# Altium project mb1367.PrjPcb (part 1 of 2)
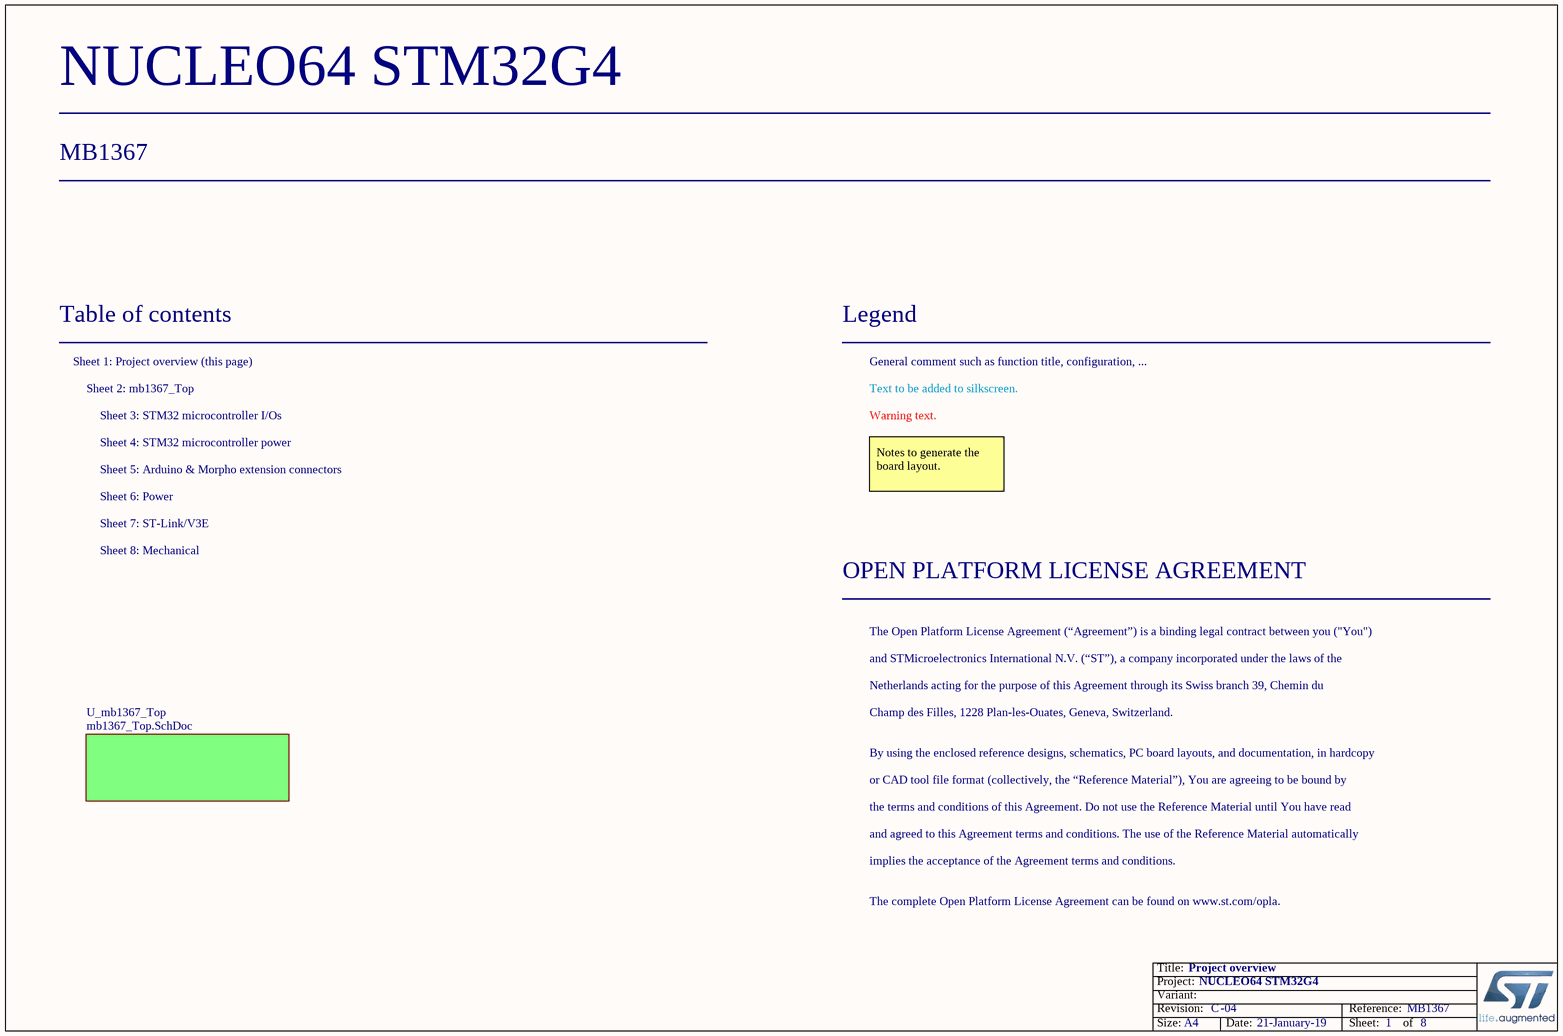
[diagram p0: Project_overview.SchDoc]
Board_Reference: MB1367; Board_PCB_Revision: C; Board_Name: NUCLEO64 STM32G4; Board_Document_Date: 21-January-19; Board_Assembly_Revision: 04
8 sheets, 201 parts. Net scope: flat (ports and power ports of the same name join across sheets).
Board file: MB1367C.PcbDoc
Sheets:
  Project_overview.SchDoc
    U_mb1367_Top = mb1367_Top.SchDoc
      U_Arduino_extension_connectors = Arduino_extension_connectors.SchDoc
      U_Power = Power.SchDoc
      U_STM32_microcontroller_IOs = STM32_microcontroller_IOs.SchDoc
      U_STM32_microcontroller_power = STM32_microcontroller_power.SchDoc
      U_ST_LINK_V3E = ST_LINK_V3E.SchDoc
      Mechanical = Mechanical.SchDoc

## Sheet Project_overview.SchDoc: Project overview
size A4; Date: Not used; ApprovedBy: Not used; CheckedBy: Not used; Author: Not used; CompanyName: STMicroelectronics; DrawnBy: Not used; Engineer: Not used; Organization: Not used; Address1: Not used; Address2: Not used; Address3: Not used; Address4: Not used; DocumentNumber: 1; Revision: Not used; SheetNumber: 1; SheetTotal: 8; CurrentTime: Not used; CurrentDate: Not used; Time: Not used; DocumentFullPathAndName: Not used; DocumentName: Not used; ModifiedDate: Not used; ImagePath: Not used; ProjectName: Not used; Application_BuildNumber: Not used

### Sub-sheets
U_mb1367_Top = mb1367_Top.SchDoc: no entries

### Notes on the sheet
- Table of contents
- Sheet 1: Project overview (this page)
- Legend
- General comment such as function title, configuration, ...
- Sheet 2: mb1367_Top
- Sheet 4: STM32 microcontroller power
- Sheet 3: STM32 microcontroller I/Os
- Text to be added to silkscreen.
- Warning text.
- Sheet 6: Power
- Sheet 5: Arduino & Morpho extension connectors
- Notes to generate the board layout.
- Sheet 7: ST-Link/V3E
- Sheet 8: Mechanical
- OPEN PLATFORM LICENSE AGREEMENT
- The Open Platform License Agreement (“Agreement”) is a binding legal contract between you ("You")
- and STMicroelectronics International N.V. (“ST”), a company incorporated under the laws of the
- Netherlands acting for the purpose of this Agreement through its Swiss branch 39, Chemin du
- Champ des Filles, 1228 Plan-les-Ouates, Geneva, Switzerland.
- By using the enclosed reference designs, schematics, PC board layouts, and documentation, in hardcopy
- or CAD tool file format (collectively, the “Reference Material”), You are agreeing to be bound by
- the terms and conditions of this Agreement. Do not use the Reference Material until You have read
- and agreed to this Agreement terms and conditions. The use of the Reference Material automatically
- implies the acceptance of the Agreement terms and conditions.
- The complete Open Platform License Agreement can be found on www.st.com/opla.
- Title:
- Project:
- Size:
- Revision:
- Variant:
- A4
- -
- Date:
- Reference:
- Sheet:
- of

## Sheet mb1367_Top.SchDoc: Top hierarchical view
size A4; Date: Not used; ApprovedBy: Not used; CheckedBy: Not used; Author: Not used; CompanyName: STMicroelectronics; DrawnBy: Not used; Engineer: Not used; Organization: Not used; Address1: Not used; Address2: Not used; Address3: Not used; Address4: Not used; DocumentNumber: 2; Revision: A-01-P3; SheetNumber: 2; SheetTotal: 8; CurrentTime: Not used; CurrentDate: Not used; Time: Not used; DocumentFullPathAndName: Not used; DocumentName: Not used; ModifiedDate: Not used; ImagePath: Not used; ProjectName: Not used; Application_BuildNumber: Not used
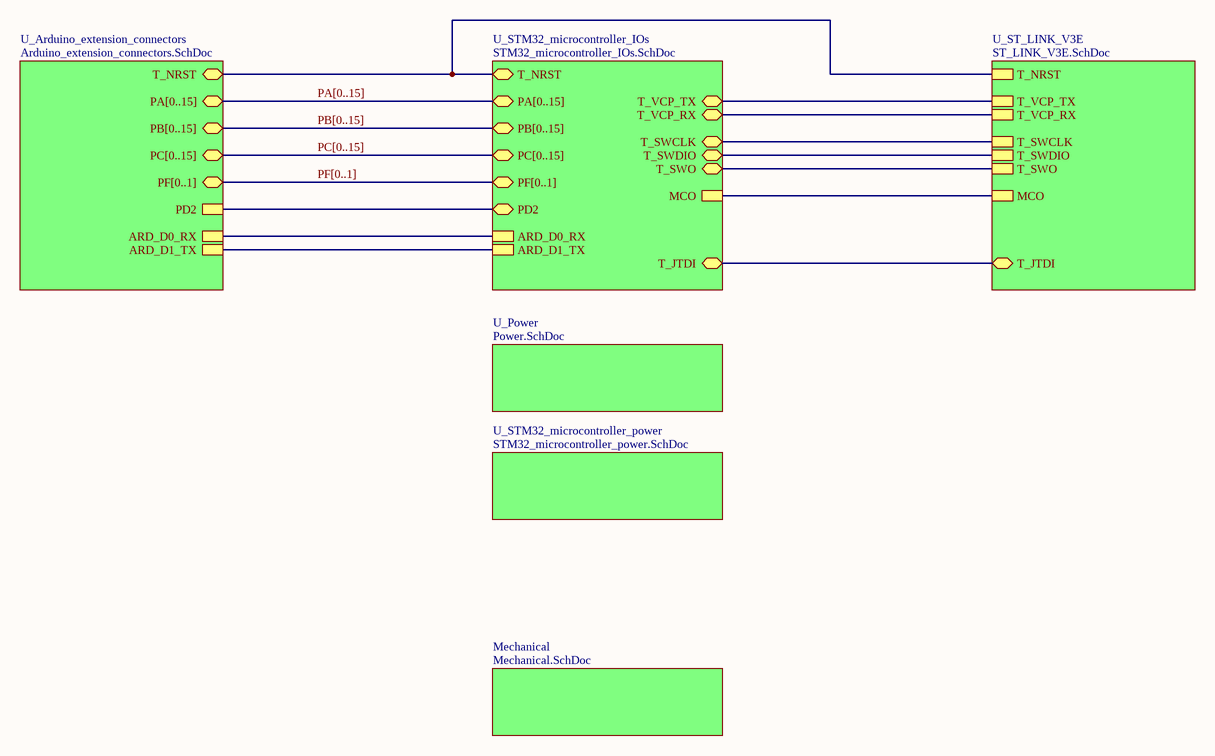
[diagram p1: mb1367_Top.SchDoc]

### Sub-sheets
Mechanical = Mechanical.SchDoc: no entries
U_Arduino_extension_connectors = Arduino_extension_connectors.SchDoc: PA[0..15] (bidir), PB[0..15] (bidir), PC[0..15] (bidir), PD2, PF[0..1] (bidir), ARD_D0_RX, ARD_D1_TX, T_NRST
U_Power = Power.SchDoc: no entries
U_ST_LINK_V3E = ST_LINK_V3E.SchDoc: T_SWCLK, T_SWO, T_NRST, MCO, T_SWDIO, T_VCP_TX, T_VCP_RX, T_JTDI
U_STM32_microcontroller_IOs = STM32_microcontroller_IOs.SchDoc: PA[0..15] (bidir), PB[0..15] (bidir), PC[0..15] (bidir), PF[0..1] (bidir), ARD_D0_RX, ARD_D1_TX, MCO, PD2, T_NRST, T_VCP_TX, T_VCP_RX, T_SWCLK, T_SWO, T_SWDIO, T_JTDI
U_STM32_microcontroller_power = STM32_microcontroller_power.SchDoc: no entries

### Nets
(unnamed): sheet U_Arduino_extension_connectors/PD2, sheet U_STM32_microcontroller_IOs/PD2
(unnamed): sheet U_Arduino_extension_connectors/ARD_D0_RX, sheet U_STM32_microcontroller_IOs/ARD_D0_RX
(unnamed): sheet U_Arduino_extension_connectors/ARD_D1_TX, sheet U_STM32_microcontroller_IOs/ARD_D1_TX
(unnamed): sheet U_Arduino_extension_connectors/T_NRST, sheet U_STM32_microcontroller_IOs/T_NRST, sheet U_ST_LINK_V3E/T_NRST
(unnamed): sheet U_STM32_microcontroller_IOs/MCO, sheet U_ST_LINK_V3E/MCO
(unnamed): sheet U_STM32_microcontroller_IOs/T_VCP_TX, sheet U_ST_LINK_V3E/T_VCP_TX
(unnamed): sheet U_STM32_microcontroller_IOs/T_VCP_RX, sheet U_ST_LINK_V3E/T_VCP_RX
(unnamed): sheet U_STM32_microcontroller_IOs/T_SWCLK, sheet U_ST_LINK_V3E/T_SWCLK
(unnamed): sheet U_STM32_microcontroller_IOs/T_SWO, sheet U_ST_LINK_V3E/T_SWO
(unnamed): sheet U_STM32_microcontroller_IOs/T_SWDIO, sheet U_ST_LINK_V3E/T_SWDIO
(unnamed): sheet U_STM32_microcontroller_IOs/T_JTDI, sheet U_ST_LINK_V3E/T_JTDI

### Buses and harness runs
bus PA[0..15] = sheet U_Arduino_extension_connectors/PA[0..15] = sheet U_STM32_microcontroller_IOs/PA[0..15]
bus PB[0..15] = sheet U_Arduino_extension_connectors/PB[0..15] = sheet U_STM32_microcontroller_IOs/PB[0..15]
bus PC[0..15] = sheet U_Arduino_extension_connectors/PC[0..15] = sheet U_STM32_microcontroller_IOs/PC[0..15]
bus PF[0..1] = sheet U_Arduino_extension_connectors/PF[0..1] = sheet U_STM32_microcontroller_IOs/PF[0..1]

### Notes on the sheet
- Cuttable part on PCB
- Title:
- Project:
- Size:
- Revision:
- Variant:
- A4
- -
- Date:
- Reference:
- Sheet:
- of

## Sheet Arduino_extension_connectors.SchDoc: Arduino & Morpho extension connectors
size A4; Date: Not used; ApprovedBy: Not used; CheckedBy: Not used; Author: Not used; CompanyName: STMicroelectronics; DrawnBy: Not used; Engineer: Not used; Organization: Not used; Address1: Not used; Address2: Not used; Address3: Not used; Address4: Not used; DocumentNumber: 5; Revision: Not used; SheetNumber: 5; SheetTotal: 8; CurrentTime: Not used; CurrentDate: Not used; Time: Not used; DocumentFullPathAndName: Not used; DocumentName: Not used; ModifiedDate: Not used; ImagePath: Not used; ProjectName: Not used; Application_BuildNumber: Not used
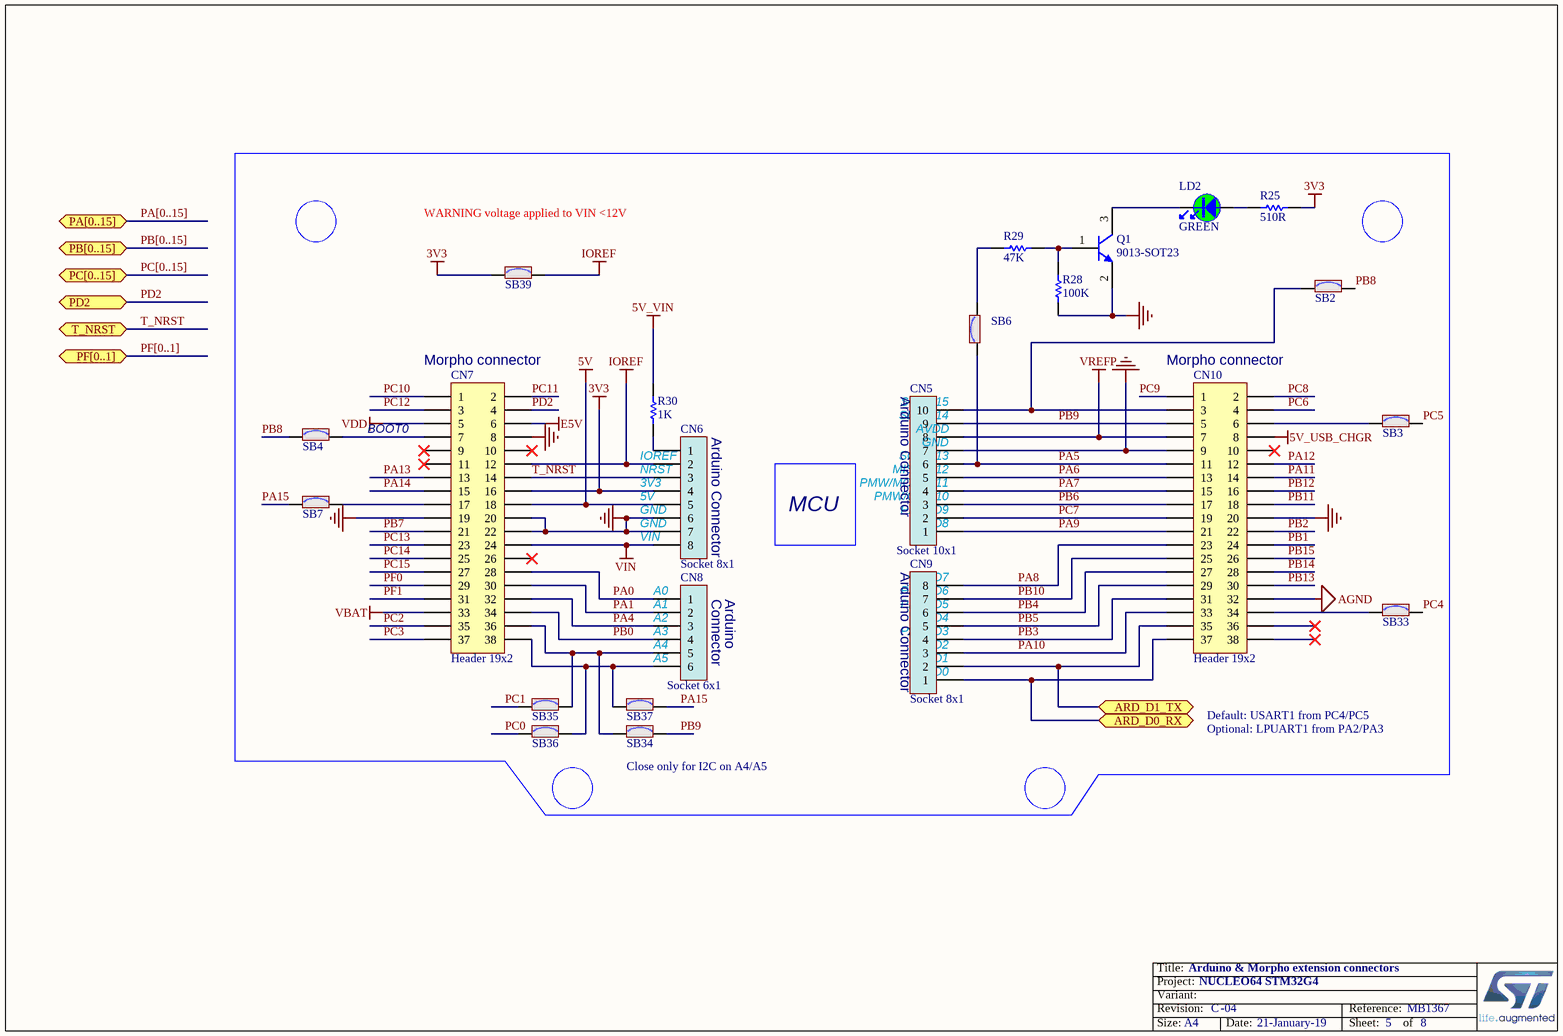
[diagram p2: Arduino_extension_connectors.SchDoc]

### Parts
CN5  value Socket 10x1  [CON_SAMTEC_SSW-110-03-X-S]
CN6  value Socket 8x1  [CON_SAMTEC_SSW-108-03-X-S]
CN7  value Header 19x2  [CON_SAMTEC_TSW-119-09-X-D]
CN8  value Socket 6x1  [CON_SAMTEC_SSW-106-03-X-S]
CN9  value Socket 8x1  [CON_SAMTEC_SSW-108-03-X-S]
CN10  value Header 19x2  [CON_SAMTEC_TSW-119-09-X-D]
LD2  value GREEN  [LED_0603_GREEN]
Q1  value 9013-SOT23  [NPN_SOT23]
R25  value 510R  [R0603]
R28  value 100K  [R0603]
R29  value 47K  [R0603]
R30  value 1K  [R0603]
SB2  (no value)  [SOLDER-BRIDGE_R0603-0R]
SB3  (no value)  [SOLDER-BRIDGE_R0603-0R]
SB4  (no value)  [SOLDER-BRIDGE_R0603-0R]
SB6  (no value)  [SOLDER-BRIDGE_R0603-0R]
SB7  (no value)  [SOLDER-BRIDGE_R0603-0R]
SB33  (no value)  [SOLDER-BRIDGE_R0603-0R]
SB34  (no value)  [SOLDER-BRIDGE_R0603-0R]
SB35  (no value)  [SOLDER-BRIDGE_R0603-0R]
SB36  (no value)  [SOLDER-BRIDGE_R0603-0R]
SB37  (no value)  [SOLDER-BRIDGE_R0603-0R]
SB39  (no value)  [SOLDER-BRIDGE_R0603-0R]

### Ports
ARD_D0_RX, ARD_D1_TX, PA[0..15] (bidir), PB[0..15] (bidir), PC[0..15] (bidir), PD2, PF[0..1] (bidir), T_NRST

### Nets
3V3: CN6.4 CN7.16 R25.1 SB39.1
5V: CN6.5 CN7.18
5V_USB_CHGR: CN10.8
5V_VIN: R30.2
AGND: CN10.32
E5V: CN7.6
GND: CN5.7 CN6.6 CN6.7 CN7.8 CN7.19 CN7.20 CN7.22 CN10.9 CN10.20 Q1.2(E) R28.1
IOREF: CN6.2 CN7.12 SB39.2
VBAT: CN7.33
VDD: CN7.5
VIN: CN6.8 CN7.24
VREFP: CN5.8 CN10.7
ARD_D0_RX: CN9.1 CN10.37 ; port ARD_D0_RX
ARD_D1_TX: CN9.2 CN10.35 ; port ARD_D1_TX
PA0: CN7.28 CN8.1
PA1: CN7.30 CN8.2
PA4: CN7.32 CN8.3
PA5: CN5.6 CN10.11 SB6.1
PA6: CN5.5 CN10.13
PA7: CN5.4 CN10.15
PA8: CN9.8 CN10.23
PA9: CN5.1 CN10.21
PA10: CN9.3 CN10.33
PA11: CN10.14
PA12: CN10.12
PA13: CN7.13
PA14: CN7.15
PA15: SB7.1 SB37.2
PB0: CN7.34 CN8.4
PB1: CN10.24
PB2: CN10.22
PB3: CN9.4 CN10.31
PB4: CN9.6 CN10.27
PB5: CN9.5 CN10.29
PB6: CN5.3 CN10.17
PB7: CN7.21
PB8: SB2.2 SB4.1
PB9: CN5.9 CN10.5 SB34.2
PB10: CN9.7 CN10.25
PB11: CN10.18
PB12: CN10.16
PB13: CN10.30
PB14: CN10.28
PB15: CN10.26
PC0: SB36.1
PC1: SB35.1
PC2: CN7.35
PC3: CN7.37
PC4: SB33.2
PC5: SB3.2
PC6: CN10.4
PC7: CN5.2 CN10.19
PC8: CN10.2
PC9: CN10.1
PC10: CN7.1
PC11: CN7.2
PC12: CN7.3
PC13: CN7.23
PC14: CN7.25
PC15: CN7.27
PD2: CN7.4 ; port PD2
PF0: CN7.29
PF1: CN7.31
T_NRST: CN6.3 CN7.14 ; port T_NRST
NetCN5_10: CN5.10 CN10.3 SB2.1
NetCN6_1: CN6.1 R30.1
NetCN7_7: CN7.7 SB4.2
NetCN7_17: CN7.17 SB7.2
NetCN7_36: CN7.36 CN8.5 SB34.1 SB35.2
NetCN7_38: CN7.38 CN8.6 SB36.2 SB37.1
NetCN10_6: CN10.6 SB3.1
NetCN10_34: CN10.34 SB33.1
NetLD2_1: LD2.1 R25.2
NetLD2_2: LD2.2 Q1.3(C)
NetQ1_1: Q1.1(B) R28.2 R29.2
NetR29_1: R29.1 SB6.2

Not connected (* = marked no-connect by the designer): CN7 9* 10* 11* 26*; CN10 10* 36* 38*

### Buses and harness runs
bus PA[0..15] = port PA[0..15]
bus PB[0..15] = port PB[0..15]
bus PC[0..15] = port PC[0..15]
bus PF[0..1] = port PF[0..1]

### Notes on the sheet
- WARNING voltage applied to VIN <12V
- (near CN7) Morpho connector
- (near CN10) Morpho connector
- (near CN7) BOOT0
- (near CN6) Arduino Connector
- (near CN5) Arduino Connector
- (near CN5) SDA/D14
- (near CN5) SCL/D15
- (near CN5) AVDD
- (near CN5) GND
- (near CN6) GND
- (near CN6) 5V
- (near CN6) 3V3
- (near CN6) NRST
- (near CN6) IOREF
- MCU
- (near CN5) PMW/D9
- (near CN5) PMW/CS/D10
- (near CN5) SCK/D13
- (near CN5) MISO/D12
- (near CN5) PMW/MOSI/D11
- (near CN6) VIN
- (near CN9) Arduino Connector
- (near CN9) D7
- (near CN5) D8
- (near CN8) A0
- (near CN8) A1
- (near CN8) A2
- (near CN8) A3
- (near CN8) A4
- (near CN8) Connector
- (near CN8) Arduino
- (near CN9) D2
- (near CN9) D4
- (near CN9) PMW/D3
- (near CN9) PMW/D5
- (near CN9) PMW/D6
- (near CN8) A5
- (near CN9) RX/D0
- (near CN9) TX/D1
- (near SB34) Close only for I2C on A4/A5
- Default: USART1 from PC4/PC5
  Optional: LPUART1 from PA2/PA3
- Title:
- Project:
- Size:
- Revision:
- Variant:
- -
- Date:
- Reference:
- Sheet:
- of

### Library data of the parts
CN5 = MCD-00262: Socket, 10x1, 2.54mm, VR, TH, Height 8.51mm/10mm; Manufacturer_Part_Number: SSW-110-03-x-S; Manufacturer: SAMTEC; Part_Type: Connector; Provided_By: Subcon; Initial_Board_Reference: MB1319; Internal_Part_Number: MCD-00262; ECCN_US: n/a; ECCN_EU: n/a; ComponentLink1Description: Samtec_SSW-SSQ-series.pdf; Status: Released; ComponentLink1URL: http://tunmcdsvn.tun.st.com/Component_Datasheet_Library/Trunk/Connectors/Samtec_SSW-SSQ-series
CN6 CN9 = MCD-00261: Socket, 8x1, 2.54mm, VR, TH, Height 8.51mm/10mm; Manufacturer_Part_Number: SSW-108-03-x-S; Manufacturer: SAMTEC; Part_Type: Connector; Provided_By: Subcon; Initial_Board_Reference: MB1319; Internal_Part_Number: MCD-00261; ECCN_US: n/a; ECCN_EU: n/a; ComponentLink1Description: Samtec_SSW-SSQ-series.pdf; Status: Released; ComponentLink1URL: http://tunmcdsvn.tun.st.com/Component_Datasheet_Library/Trunk/Connectors/Samtec_SSW-SSQ-series
CN7 CN10 = MCD-00213: Header, 19x2, 2,54mm, VR, TH, Height 5.84mm/10.16mm; Manufacturer_Part_Number: TSW-119-09-x-D; Manufacturer: SAMTEC; Part_Type: Connector; Provided_By: Subcon; Initial_Board_Reference: MB1319; Internal_Part_Number: MCD-00213; ECCN_US: n/a; ECCN_EU: n/a; ComponentLink1Description: Samtec_connector_TSW-HTSW-series.pdf; Status: Released; ComponentLink1URL: http://tunmcdsvn.tun.st.com/Component_Datasheet_Library/Trunk/Connectors/Samtec_TSW-HTSW-series
CN8 = MCD-00260: Socket, 6x1, 2.54mm, VR, TH, Height 8.51mm/10mm; Manufacturer_Part_Number: SSW-106-03-x-S; Manufacturer: SAMTEC; Part_Type: Connector; Provided_By: Subcon; Initial_Board_Reference: MB1319; Internal_Part_Number: MCD-00260; ECCN_US: n/a; ECCN_EU: n/a; ComponentLink1Description: Samtec_SSW-SSQ-series.pdf; Status: Released; ComponentLink1URL: http://tunmcdsvn.tun.st.com/Component_Datasheet_Library/Trunk/Connectors/Samtec_SSW-SSQ-series
LD2 = MCD-00050: LED, Green, 0603; Manufacturer_Part_Number: 19-213SYGC/S530-E2/TR8; Manufacturer: EVERLIGHT; Part_Type: Display; ECCN_US: EAR99; ECCN_EU: NEC; Provided_By: Subcon; Initial_Board_Reference: MB1274; Internal_Part_Number: MCD-00050; ComponentLink1Description: Everlight_SMD-LED-GREEN_19-213SYGC-S530-XX-TR8-v3.doc.pdf; Status: Released; ComponentLink1URL: http://tunmcdsvn.tun.st.com/Component_Datasheet_Library/Trunk/display/Everlight_SMD-LED-GREEN_19-213SYGC-S530-XX-TR8-v3.doc; Package: LED 0603
Q1 = MCD-00073: NPN Bipolar Transistor; Part_Type: IC; Manufacturer_Part_Number: BSR14; Manufacturer: NXP; ECCN_US: EAR99; ECCN_EU: NEC; Provided_By: Subcon; Initial_Board_Reference: MB1274; Revision: *; Internal_Part_Number: MCD-00073; Status: Released; ComponentLink1Description: NXP_Transistor_BSR14.pdf; ComponentLink1URL: http://tunmcdsvn.tun.st.com/Component_Datasheet_Library/Trunk/IC/NXP_Transistor_BSR14
R25 = MCD-00225: Resistor,510R,0603,1%,1/10W; Manufacturer_Part_Number: RC0603FR-07510RL; Manufacturer: YAGEO; Provided_By: Subcon; Initial_Board_Reference: MB1319; Internal_Part_Number: MCD-00225; ECCN_US: n/a; ECCN_EU: n/a; ComponentLink1Description: Yageo_Resistor_RC0603-series.pdf; Status: Released; Part_Type: Resistor; Package: R0603; ComponentLink1URL: http://tunmcdsvn.tun.st.com/Component_Datasheet_Library/Trunk/Resistors/Yageo_Resistor_RC0603-series
R28 = MCD-00223: Resistor,100K,0603,1%,1/10W; Manufacturer_Part_Number: RC0603FR-07100KL; Manufacturer: YAGEO; Provided_By: Subcon; Initial_Board_Reference: MB1319; Internal_Part_Number: MCD-00223; Status: Released; Part_Type: Resistor; ComponentLink1Description: Yageo_Resistor_RC0603-series.pdf; ECCN_US: n/a; ECCN_EU: n/a; Package: R0603; ComponentLink1URL: http://tunmcdsvn.tun.st.com/Component_Datasheet_Library/Trunk/Resistors/Yageo_Resistor_RC0603-series
R29 = MCD-00222: Resistor,47K,0603,1%,1/10W; Manufacturer_Part_Number: RC0603FR-0747KL; Manufacturer: YAGEO; Provided_By: Subcon; Initial_Board_Reference: MB1319; Internal_Part_Number: MCD-00222; Status: Released; Part_Type: Resistor; ComponentLink1Description: Yageo_Resistor_RC0603-series.pdf; ECCN_US: n/a; ECCN_EU: n/a; Package: R0603; ComponentLink1URL: http://tunmcdsvn.tun.st.com/Component_Datasheet_Library/Trunk/Resistors/Yageo_Resistor_RC0603-series
R30 = MCD-00070: Resistor,1K,0603,1%,1/10W; Manufacturer_Part_Number: RC0603FR-071KL; Manufacturer: YAGEO; Provided_By: Subcon; Initial_Board_Reference: MB1274; Internal_Part_Number: MCD-00070; ComponentLink1Description: Yageo_Resistor_RC0603-series.pdf; ECCN_US: n/a; ECCN_EU: n/a; Status: Released; Part_Type: Resistor; Package: R0603; ComponentLink1URL: http://tunmcdsvn.tun.st.com/Component_Datasheet_Library/Trunk/Resistors/Yageo_Resistor_RC0603-series
SB2-SB4 SB6 SB7 SB33-SB37 SB39 = MCD-00071: Solder Bridge ON; Part_Type: Mechanical; Provided_By: Subcon; Initial_Board_Reference: MB1274; Internal_Part_Number: MCD-00071; ECCN_US: n/a; ECCN_EU: n/a; Status: Released

## Sheet Power.SchDoc: Main power 5V / 3V3
size A4; Date: Not used; ApprovedBy: Not used; CheckedBy: Not used; Author: Not used; CompanyName: STMicroelectronics; DrawnBy: Not used; Engineer: Not used; Organization: Not used; Address1: Not used; Address2: Not used; Address3: Not used; Address4: Not used; DocumentNumber: 6; Revision: Not used; SheetNumber: 6; SheetTotal: 8; CurrentTime: Not used; CurrentDate: Not used; Time: Not used; DocumentFullPathAndName: Not used; DocumentName: Not used; ModifiedDate: Not used; ImagePath: Not used; ProjectName: Not used; Application_BuildNumber: Not used
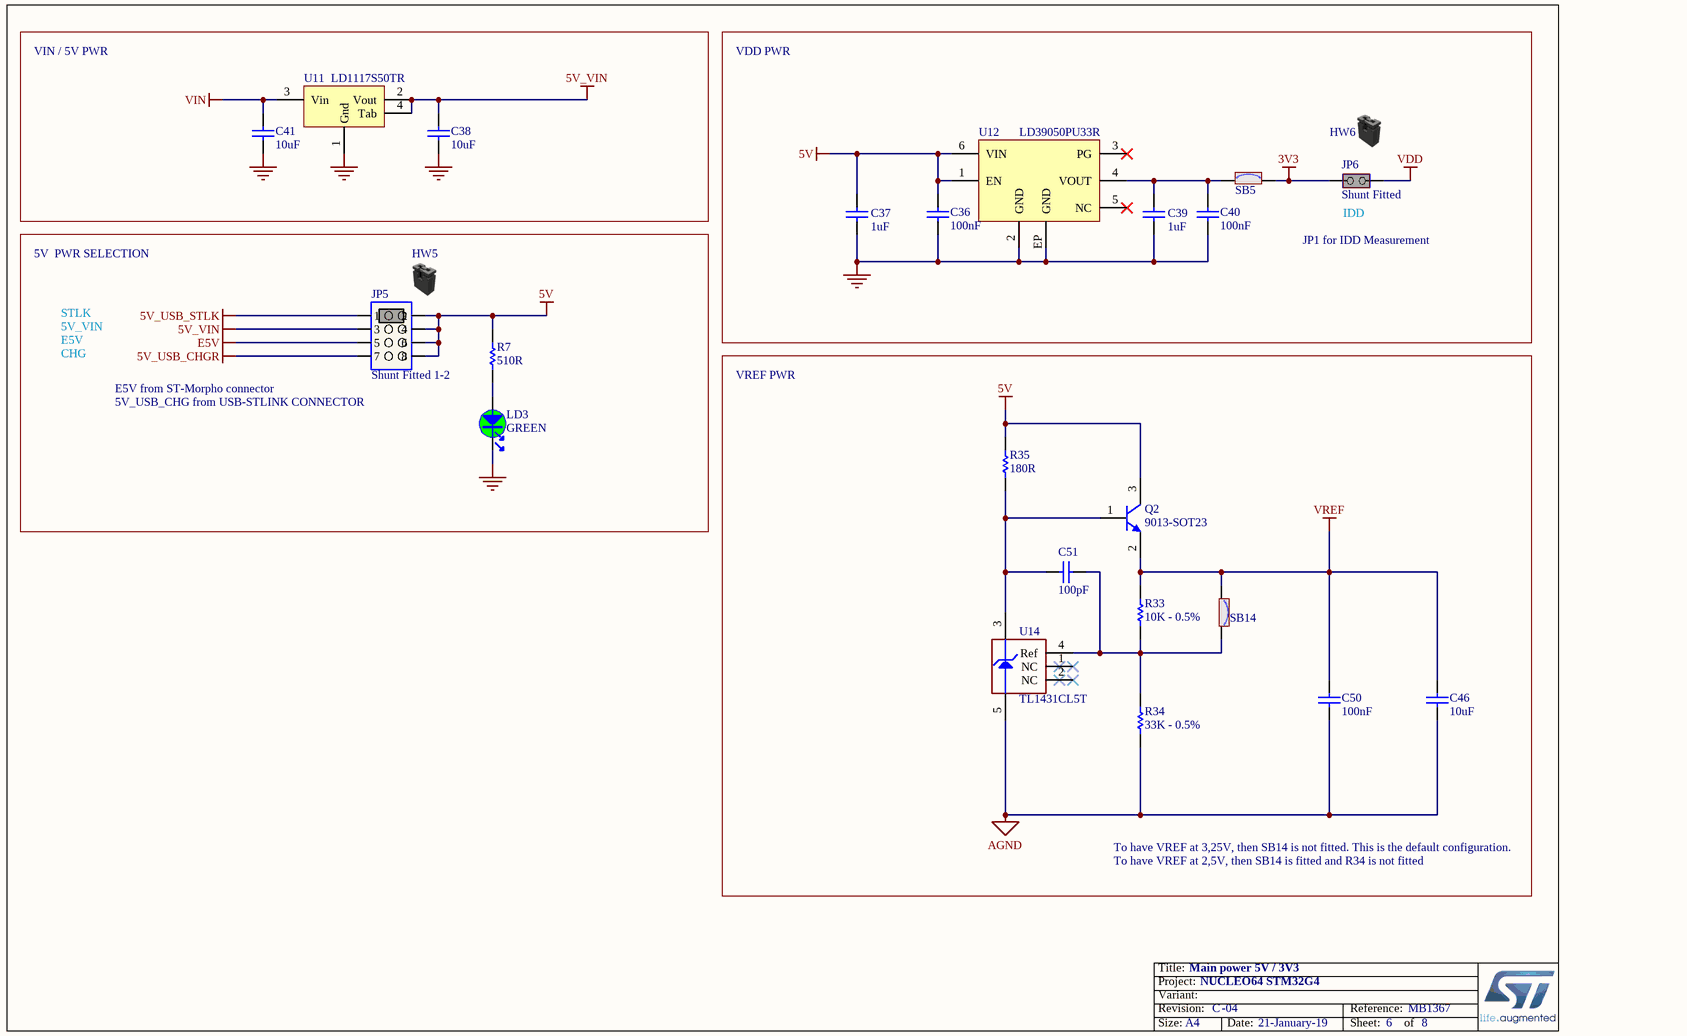
[diagram p3: Power.SchDoc]

### Parts
C36  value 100nF  [C0402]
C37  value 1uF  [C0603]
C38  value 10uF  [C0805]
C39  value 1uF  [C0603]
C40  value 100nF  [C0402]
C41  value 10uF  [C0805]
C46  value 10uF  [C0603]  (hidden comment: Capacitor)
C50  value 100nF  [C0603]
C51  value 100pF  [C0603]  (hidden comment: Capacitor)
HW5  (no value)  (mechanical)
HW6  (no value)  (mechanical)
JP5  Shunt Fitted 1-2  [CON_SAMTEC_TSW-104-07-X-D]
JP6  Shunt Fitted  [CON_SAMTEC_TSW-102-07-G-S]
LD3  value GREEN  [LED_0603_GREEN]
Q2  value 9013-SOT23  [NPN_SOT23]
R7  value 510R  [R0603]
R33  value 10K - 0.5%  [R0603]  (hidden comment: ​Add 0.5% tolerance resistor)
R34  value 33K - 0.5%  [R0603]  (hidden comment: ​add 0.5% tolerance resistor)
R35  value 180R  [R0603]  (hidden comment: Resistor)
SB5  (no value)  [SOLDER-BRIDGE_R0603-0R]
SB14  (no value)  [SOLDER-BRIDGE_R0603-0R]
U11  value LD1117S50TR  [REG_SOT223-TAB]
U12  value LD39050PU33R  [ICC_DFN6-EPAD_3X3_P095]
U14  value TL1431CL5T  [ICC_SOT23-5L_H1P45]  (hidden comment: TL1431ACL5T)

### Blocks framed on the sheet
VIN / 5V PWR: C38 C41 U11
VREF PWR: C46 C50 C51 Q2 R33-R35 SB14 U14

### Nets
3V3: JP6.1(COMMON) SB5.2
5V: C36.2 C37.2 JP5.2 JP5.4 JP5.6 JP5.8 Q2.3(C) R7.2 R35.2 U12.1(EN) U12.6(VIN)
5V_USB_CHGR: JP5.7
5V_USB_STLK: JP5.1
5V_VIN: C38.2 JP5.3 U11.2(Vout) U11.4(Tab)
AGND: C46.1 C50.1 R34.1 U14.5(Anode)
E5V: JP5.5
GND: C36.1 C37.1 C38.1 C39.1 C40.1 C41.1 LD3.2 U11.1(Gnd) U12.2(GND) U12.EP(GND)
VDD: JP6.2(NO)
VIN: C41.2 U11.3(Vin)
VREF: C46.2 C50.2 Q2.2(E) R33.2 SB14.1
NetC39_2: C39.2 C40.2 SB5.1 U12.4(VOUT)
NetC51_1: C51.1 Q2.1(B) R35.1 U14.3(Cathode)
NetC51_2: C51.2 R33.1 R34.2 SB14.2 U14.4(Ref)
NetLD3_1: LD3.1 R7.1

Not connected (* = marked no-connect by the designer): U12 3(PG)* 5(NC)*; U14 1(NC)* 2(NC)*

### Notes on the sheet
- VDD PWR
- JP1 for IDD Measurement
- (near JP6) IDD
- 5V  PWR SELECTION
- STLK
- E5V
- 5V_VIN
- CHG
- E5V from ST-Morpho connector
- 5V_USB_CHG from USB-STLINK CONNECTOR
- To have VREF at 3,25V, then SB14 is not fitted. This is the default configuration.
- To have VREF at 2,5V, then SB14 is fitted and R34 is not fitted
- Title:
- Project:
- Size:
- Revision:
- Variant:
- A4
- -
- Date:
- Reference:
- Sheet:
- of

### Library data of the parts
C36 C40 = MCD-00102: Capacitor, MLCC, 100nF, 16V, X7R, 10%, 0402, T=0,5mm; Manufacturer_Part_Number: CC0402KRX7R7BB104; Manufacturer: YAGEO; Provided_By: Subcon; Initial_Board_Reference: MB1262; Internal_Part_Number: MCD-00102; Status: Released; Package: C0402; ComponentLink1Description: Yageo_Capacitor_X7R-series.pdf; ECCN_US: n/a; ECCN_EU: n/a; Part_Type: Capacitor; ComponentLink1URL: http://tunmcdsvn.tun.st.com/Component_Datasheet_Library/Trunk/Capacitors/Yageo_Multilayer_Capacitor_X7R_series_100pF_to_22uF
C37 C39 = MCD-00010: Capacitor, MLCC, 1uF, 16V, X5R, 10%, 0603, T=0,8mm; Manufacturer_Part_Number: CC0603KRX5R7BB105; Manufacturer: YAGEO; Provided_By: Subcon; Initial_Board_Reference: MB1274; Internal_Part_Number: MCD-00010; Status: Released; Package: C0603; ComponentLink1Description: Yageo_Capacitor_X5R-series.pdf; ECCN_US: n/a; ECCN_EU: n/a; Part_Type: Capacitor; ComponentLink1URL: http://tunmcdsvn.tun.st.com/Component_Datasheet_Library/Trunk/Capacitors/Yageo_Multilayer_capacitor_X5R_series_100pF_to_100uF
C38 C41 = MCD-00014: Capacitor, MLCC, 10uF, 25V, X5R, 10%, 0805, T=0,85mm; Manufacturer_Part_Number: CC0805KRX5R8BB106; Manufacturer: YAGEO; Provided_By: Subcon; Initial_Board_Reference: MB1274; Internal_Part_Number: MCD-00014; ECCN_US: n/a; ECCN_EU: n/a; ComponentLink1Description: Yageo_Capacitor_X5R-series.pdf; Status: Released; Part_Type: Capacitor; Package: C0805; ComponentLink1URL: http://tunmcdsvn.tun.st.com/Component_Datasheet_Library/Trunk/Capacitors/Yageo_Multilayer_capacitor_X5R_series_100pF_to_100uF
C46 = MCD-01124: Capacitor, MLCC, 10µF, 10V, X5R, 10%, 0603, T=0.8mm; Manufacturer_Part_Number: GRM188R61A106KAAL; Manufacturer: MURATA; ECCN_US: EAR99; ECCN_EU: NEC; Provided_By: Subcon; Initial_Board_Reference: MB1361; Internal_Part_Number: MCD-01124; Status: Footprint available; Part_Type: Capacitor; Package: C0603; ComponentLink1Description: Murata_Capacitor_GRM188R61A106KAAL.pdf; ComponentLink1URL: http://tunmcdsvn.tun.st.com/Component_Datasheet_Library/Trunk/Capacitors/Murata_Capacitor_GR_series
C50 = MCD-00211: Capacitor, MLCC, 100nF, 16V, X7R, 10%, 0603, T=0,8mm; Manufacturer_Part_Number: CC0603KRX7R7BB104; Manufacturer: YAGEO; Provided_By: Subcon; Initial_Board_Reference: MB1319; Internal_Part_Number: MCD-00211; Status: Released; Part_Type: Capacitor; Package: C0603; ComponentLink1Description: Yageo_Capacitor_X7R-series.pdf; ComponentLink1URL: http://tunmcdsvn.tun.st.com/Component_Datasheet_Library/Trunk/Capacitors/Yageo_Multilayer_Capacitor_X7R_series_100pF_to_22uF; ECCN_US: n/a; ECCN_EU: n/a
C51 = MCD-01101: Capacitor,100pF,50V,X7R,10%,0603; Manufacturer_Part_Number: 06035C101JAT4A; Manufacturer: AVX; Provided_By: Subcon; Initial_Board_Reference: MB1381; Internal_Part_Number: MCD-01101; Status: Footprint available; Part_Type: Capacitor; Package: C0603; ComponentLink1Description: AVX_X7R-series.pdf; ComponentLink1URL: http://tunmcdsvn.tun.st.com/Component_Datasheet_Library/Trunk/Capacitors/AVX_Capacitor_X7R-series/AVX_X7R-series.pdf; ECCN_US: n/a; ECCN_EU: n/a
HW5 HW6 = MCD-00043: SHUNT 2.54mm BLACK; Manufacturer_Part_Number: SNT-100-BK-G; Manufacturer: SAMTEC; Part_Type: Mechanical; Provided_By: Subcon; Initial_Board_Reference: MB1274; Internal_Part_Number: MCD-00043; ECCN_US: n/a; ECCN_EU: n/a; ComponentLink1Description: Samtec_Shunt_Jumper_SNT100.pdf; Status: Released; ComponentLink1URL: http://tunmcdsvn.tun.st.com/Component_Datasheet_Library/Trunk/Connectors/Samtec_Shunt_Jumper_SNT100
JP5 = MCD-00686: Header, 4x2, 2,54mm, VR, TH, Height 5.84mm/2.54mm - Shunt Fitted 1-2; Part_Type: Connector; Manufacturer_Part_Number: TSW-104-07-x-D; Manufacturer: SAMTEC; Provided_By: Subcon; Initial_Board_Reference: MB1331; Internal_Part_Number: MCD-00686; Value: Shunt Fitted 1-2; Status: Symbol available; ComponentLink1Description: Samtec_TSW-HTSW-series.pdf; ComponentLink1URL: http://tunmcdsvn.tun.st.com/Component_Datasheet_Library/Trunk/Connectors/Samtec_TSW-HTSW-series; ECCN_US: n/a; ECCN_EU: n/a
JP6 = MCD-00683: Header, 2x1, 2,54mm, VR, TH, Height 5.84mm/2.54mm - Shunt Fitted by default; Part_Type: Connector; Manufacturer_Part_Number: TSW-102-07-x-S; Manufacturer: SAMTEC; Provided_By: Subcon; Initial_Board_Reference: MB1331; Internal_Part_Number: MCD-00683; Value: Shunt Fitted; Status: Released; ComponentLink1Description: Samtec_connector_TSW-HTSW-series.pdf; ComponentLink1URL: http://tunmcdsvn.tun.st.com/Component_Datasheet_Library/Trunk/Connectors/Samtec_TSW-HTSW-series; ECCN_US: n/a; ECCN_EU: n/a
LD3 = MCD-00050: as LD2 on sheet Arduino_extension_connectors; Internal_Part_Number: MCD-00050; ComponentLink1Description: Everlight_SMD-LED-GREEN_19-213SYGC-S530-XX-TR8-v3.doc.pdf; Status: Released; ComponentLink1URL: http://tunmcdsvn.tun.st.com/Component_Datasheet_Library/Trunk/display/Everlight_SMD-LED-GREEN_19-213SYGC-S530-XX-TR8-v3.doc; Package: LED 0603
Q2 = MCD-00073: as Q1 on sheet Arduino_extension_connectors; Revision: *; Internal_Part_Number: MCD-00073; Status: Released; ComponentLink1Description: NXP_Transistor_BSR14.pdf; ComponentLink1URL: http://tunmcdsvn.tun.st.com/Component_Datasheet_Library/Trunk/IC/NXP_Transistor_BSR14
R7 = MCD-00225: as R25 on sheet Arduino_extension_connectors; Internal_Part_Number: MCD-00225; ECCN_US: n/a; ECCN_EU: n/a; ComponentLink1Description: Yageo_Resistor_RC0603-series.pdf; Status: Released; Part_Type: Resistor; Package: R0603; ComponentLink1URL: http://tunmcdsvn.tun.st.com/Component_Datasheet_Library/Trunk/Resistors/Yageo_Resistor_RC0603-series
R33 = MCD-01215: resistor, 10K, 0603, 0.5%, 1/10W; Manufacturer_Part_Number: RC0603DR-0710KL; Manufacturer: YAGEO; ECCN_US: NA; Provided_By: Subcon; Initial_Board_Reference: MB1367; Internal_Part_Number: MCD-01215; Status: Checked; Part_Type: Resistor; Package: R0603; ComponentLink1Description: RC_Group_51_RoHS_L_7.pdf; ComponentLink1URL: http://tunmcdsvn.tun.st.com/Component_Datasheet_Library/Trunk/Resistors/Yageo_Resistor_RC0603-series/RC_Group_51_RoHS_L_7.pdf; ECCN_EU: NA
R34 = MCD-01209: Resistor,33K,0603,0.5%,1/10W; Manufacturer_Part_Number: RC0603DR-0733KL; Manufacturer: YAGEO; Provided_By: Subcon; Initial_Board_Reference: MB1367; Internal_Part_Number: MCD-01209; Status: Checked; Part_Type: Resistor; Package: R0603; ComponentLink1Description: RC_Group_51_RoHS_L_7.pdf; ComponentLink1URL: http://tunmcdsvn.tun.st.com/Component_Datasheet_Library/Trunk/Resistors/Yageo_Resistor_RC0603-series/RC_Group_51_RoHS_L_7.pdf; ECCN_US: n/a; ECCN_EU: n/a
R35 = MCD-00342: Resistor,180R,0603,1%,1/10W; Manufacturer_Part_Number: RC0603FR-07180RL; Manufacturer: YAGEO; ECCN_US: EAR99; ECCN_EU: NEC; Provided_By: SUBCO; Internal_Part_Number: MCD-00342; Status: Released; Part_Type: Resistor; Package: R0603; ComponentLink1Description: Datasheet; ComponentLink1URL: http://tunmcdsvn.tun.st.com/Component_Datasheet_Library/Trunk/Resistors/Yageo_Resistor_RC0603-series
SB5 SB14 = MCD-00071: as SB2 on sheet Arduino_extension_connectors; Internal_Part_Number: MCD-00071; ECCN_US: n/a; ECCN_EU: n/a; Status: Released
U11 = MCD-00088: IC REG LDO 5V 0.8A SOT223; Manufacturer: STMICROELECTRONICS; ECCN_US: EAR99; ECCN_EU: NEC; Provided_By: Subcon; Initial_Board_Reference: MB1274; Internal_Part_Number: MCD-00088; Manufacturer_Part_Number: LD1117S50TR; ComponentLink1Description: STM_LDO_LD1117.pdf; Status: Released; Part_Type: IC; ComponentLink1URL: http://tunmcdsvn.tun.st.com/Component_Datasheet_Library/Trunk/IC/STM_LDO_LD1117
U12 = MCD-00215: Low quiescent current and low noise voltage regulators; Manufacturer: STMICROELECTRONICS; Part_Type: IC; ECCN_US: EAR99; ECCN_EU: NEC; Provided_By: Subcon; Initial_Board_Reference: MB1319; Internal_Part_Number: MCD-00215; Manufacturer_Part_Number: LD39050PU33R; Status: Released; ComponentLink1Description: STM_LDO_LD39050PU.pdf; ComponentLink1URL: http://tunmcdsvn.tun.st.com/Component_Datasheet_Library/Trunk/IC/STM_LDO_LD39050PU
U14 = MCD-01802: Programmable voltage reference with 0.4% voltage precision; Part_Type: IC; Manufacturer: STMICROELECTRONICS; ECCN_US: EAR99; ECCN_EU: NEC; Provided_By: SUBCO with ST control; Internal_Part_Number: MCD-01802; Status: Footprint available; Manufacturer_Part_Number: TL1431CL5T; Package: SOT23-5L; ComponentLink1Description: Datasheet; ComponentLink1URL: http://tunmcdsvn.tun.st.com/Component_Datasheet_Library/Trunk/IC/STM_voltage_reference_TL1431ACL5T/

## Sheet STM32_microcontroller_IOs.SchDoc: STM32 microcontroller I/Os
size A4; Date: Not used; ApprovedBy: Not used; CheckedBy: Not used; Author: Not used; CompanyName: STMicroelectronics; DrawnBy: Not used; Engineer: Not used; Organization: Not used; Address1: Not used; Address2: Not used; Address3: Not used; Address4: Not used; DocumentNumber: 3; Revision: Not used; SheetNumber: 3; SheetTotal: 8; CurrentTime: Not used; CurrentDate: Not used; Time: Not used; DocumentFullPathAndName: Not used; DocumentName: Not used; ModifiedDate: Not used; ImagePath: Not used; ProjectName: Not used; Application_BuildNumber: Not used
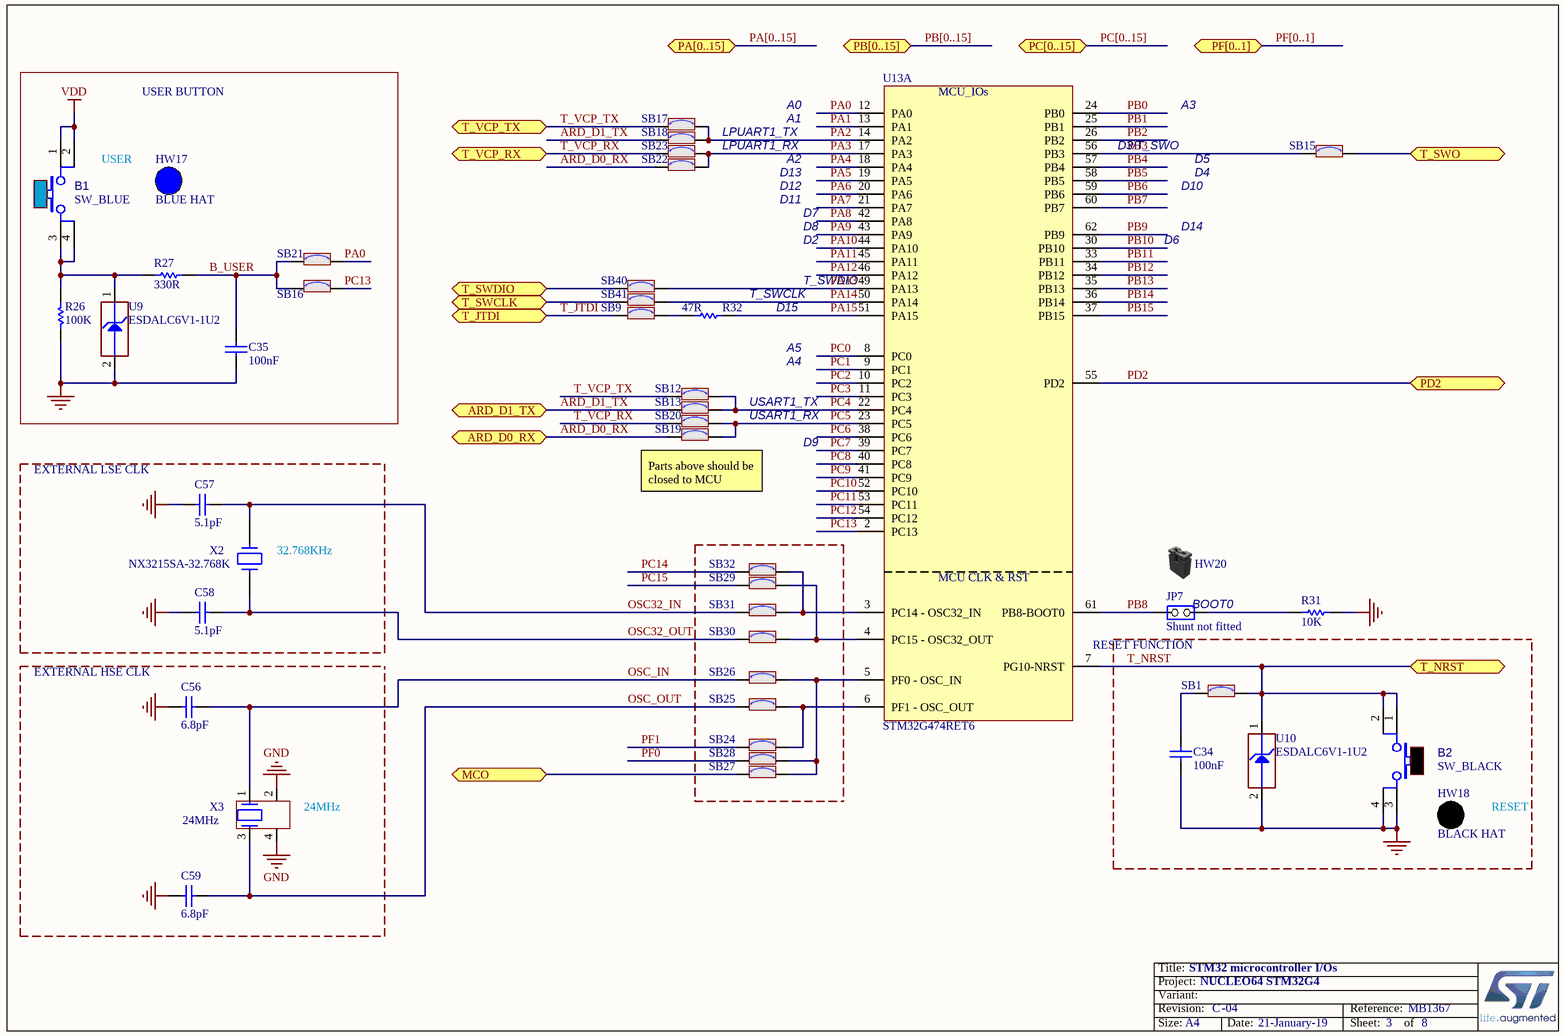
[diagram p4: STM32_microcontroller_IOs.SchDoc]

### Parts
B1  value SW_BLUE  [SWI_WEALTHMETAL_TD-0341_4P_BLUE]
B2  value SW_BLACK  [SWI_WEALTHMETAL_TD-0341_4P_BLACK]
C34  value 100nF  [C0402]
C35  value 100nF  [C0402]
C56  value 6.8pF  [C0402]
C57  value 5.1pF  [C0402]
C58  value 5.1pF  [C0402]
C59  value 6.8pF  [C0402]
HW17  value BLUE HAT  (mechanical)
HW18  value BLACK HAT  (mechanical)
HW20  (no value)  (mechanical)
JP7  value Shunt not fitted  [CON_SAMTEC_TSW-102-07-G-S]
R26  value 100K  [R0603]
R27  value 330R  [R0603]
R31  value 10K  [R0603]
R32  value 47R  [R0402]  (hidden comment: Resistor)
SB1  (no value)  [SOLDER-BRIDGE_R0603-0R]
SB9  (no value)  [SOLDER-BRIDGE_R0603-0R]
SB12  (no value)  [SOLDER-BRIDGE_R0603-0R]
SB13  (no value)  [SOLDER-BRIDGE_R0603-0R]
SB15  (no value)  [SOLDER-BRIDGE_R0603-0R]
SB16  (no value)  [SOLDER-BRIDGE_R0603-0R]
SB17  (no value)  [SOLDER-BRIDGE_R0603-0R]
SB18  (no value)  [SOLDER-BRIDGE_R0603-0R]
SB19  (no value)  [SOLDER-BRIDGE_R0603-0R]
SB20  (no value)  [SOLDER-BRIDGE_R0603-0R]
SB21  (no value)  [SOLDER-BRIDGE_R0603-0R]
SB22  (no value)  [SOLDER-BRIDGE_R0603-0R]
SB23  (no value)  [SOLDER-BRIDGE_R0603-0R]
SB24  (no value)  [SOLDER-BRIDGE_R0603-0R]
SB25  (no value)  [SOLDER-BRIDGE_R0603-0R]
SB26  (no value)  [SOLDER-BRIDGE_R0603-0R]
SB27  (no value)  [SOLDER-BRIDGE_R0603-0R]
SB28  (no value)  [SOLDER-BRIDGE_R0603-0R]
SB29  (no value)  [SOLDER-BRIDGE_R0603-0R]
SB30  (no value)  [SOLDER-BRIDGE_R0603-0R]
SB31  (no value)  [SOLDER-BRIDGE_R0603-0R]
SB32  (no value)  [SOLDER-BRIDGE_R0603-0R]
SB40  (no value)  [SOLDER-BRIDGE_R0603-0R]
SB41  (no value)  [SOLDER-BRIDGE_R0603-0R]
U9  value ESDALC6V1-1U2  [ESD_ST0201]
U10  value ESDALC6V1-1U2  [ESD_ST0201]
U13  value STM32G474RET6  [ICC_LQFP64_10X10_P050_SOCKET_YAMAICHI_IC149-064-069-B5_NM]  (hidden comment: STM32G4xx_LQFP64)  (part A of 2)
X2  value NX3215SA-32.768K  [CRY_NX3215SA_2P]
X3  value 24MHz  [CRY_NX2016SA_4P]

### Ports
ARD_D0_RX, ARD_D1_TX, MCO, PA[0..15] (bidir), PB[0..15] (bidir), PC[0..15] (bidir), PD2, PF[0..1] (bidir), T_JTDI, T_NRST, T_SWCLK, T_SWDIO, T_SWO, T_VCP_RX, T_VCP_TX

### Nets
GND: B2.3 B2.4 C34.1 C35.1 C56.1 C57.2 C58.2 C59.1 R26.1 R31.1 U9.2(GND) U10.2(GND) X3.2 X3.4
VDD: B1.1 B1.2
ARD_D0_RX: SB19.2 SB22.2 ; port ARD_D0_RX
ARD_D1_TX: SB13.2 SB18.2 ; port ARD_D1_TX
B_USER: C35.2 R27.2 SB16.1 SB21.1
MCO: SB27.1 ; port MCO
OSC32_IN: C57.1 SB31.1 X2.1
OSC32_OUT: C58.1 SB30.1 X2.2
OSC_IN: C56.2 SB26.1 X3.1
OSC_OUT: C59.2 SB25.1 X3.3
PA0: SB21.2 U13.12(PA0)
PA1: U13.13(PA1)
PA2: SB17.2 SB18.1 U13.14(PA2)
PA3: SB22.1 SB23.2 U13.17(PA3)
PA4: U13.18(PA4)
PA5: U13.19(PA5)
PA6: U13.20(PA6)
PA7: U13.21(PA7)
PA8: U13.42(PA8)
PA9: U13.43(PA9)
PA10: U13.44(PA10)
PA11: U13.45(PA11)
PA12: U13.46(PA12)
PA13: SB40.2 U13.49(PA13)
PA14: SB41.2 U13.50(PA14)
PA15: R32.2 U13.51(PA15)
PB0: U13.24(PB0)
PB1: U13.25(PB1)
PB2: U13.26(PB2)
PB3: SB15.1 U13.56(PB3)
PB4: U13.57(PB4)
PB5: U13.58(PB5)
PB6: U13.59(PB6)
PB7: U13.60(PB7)
PB8: JP7.1(COMMON) U13.61(PB8-BOOT0)
PB9: U13.62(PB9)
PB10: U13.30(PB10)
PB11: U13.33(PB11)
PB12: U13.34(PB12)
PB13: U13.35(PB13)
PB14: U13.36(PB14)
PB15: U13.37(PB15)
PC0: U13.8(PC0)
PC1: U13.9(PC1)
PC2: U13.10(PC2)
PC3: U13.11(PC3)
PC4: SB12.2 SB13.1 U13.22(PC4)
PC5: SB19.1 SB20.2 U13.23(PC5)
PC6: U13.38(PC6)
PC7: U13.39(PC7)
PC8: U13.40(PC8)
PC9: U13.41(PC9)
PC10: U13.52(PC10)
PC11: U13.53(PC11)
PC12: U13.54(PC12)
PC13: SB16.2 U13.2(PC13)
PC14: SB32.1
PC15: SB29.1
PD2: U13.55(PD2) ; port PD2
PF0: SB28.1
PF1: SB24.1
T_JTDI: SB9.1 ; port T_JTDI
T_NRST: B2.1 B2.2 SB1.2 U10.1(IO1) U13.7(PG10-NRST) ; port T_NRST
T_SWCLK: SB41.1 ; port T_SWCLK
T_SWDIO: SB40.1 ; port T_SWDIO
T_SWO: SB15.2 ; port T_SWO
T_VCP_RX: SB20.1 SB23.1 ; port T_VCP_RX
T_VCP_TX: SB12.1 SB17.1 ; port T_VCP_TX
NetB1_3: B1.3 B1.4 R26.2 R27.1 U9.1(IO1)
NetC34_2: C34.2 SB1.1
NetJP7_2: JP7.2(NO) R31.2
NetR32_1: R32.1 SB9.2
NetSB24_2: SB24.2 SB25.2 U13.6(PF1_-_OSC_OUT)
NetSB26_2: SB26.2 SB27.2 SB28.2 U13.5(PF0_-_OSC_IN)
NetSB29_2: SB29.2 SB30.2 U13.4(PC15_-_OSC32_OUT)
NetSB31_2: SB31.2 SB32.2 U13.3(PC14_-_OSC32_IN)

### Buses and harness runs
bus PA[0..15] = port PA[0..15]
bus PB[0..15] = port PB[0..15]
bus PC[0..15] = port PC[0..15]
bus PF[0..1] = port PF[0..1]

### Notes on the sheet
- USER BUTTON
- A0
- A3
- USER
- LPUART1_TX
- LPUART1_RX
- A1
- A2
- D13
- D3/T_SWO
- D4
- D5
- D12
- D11
- D2
- D7
- D8
- D14
- D10
- D6
- (near R32) T_SWCLK
- D15
- (near R32) T_SWDIO
- A4
- A5
- USART1_RX
- USART1_TX
- D9
- EXTERNAL LSE CLK
- (near SB19) Parts above should be closed to MCU
- (near X2) 32.768KHz
- RESET FUNCTION
- BOOT0
- EXTERNAL HSE CLK
- (near X3) 24MHz
- RESET
- Title:
- Project:
- Size:
- Revision:
- Variant:
- -
- Date:
- Reference:
- Sheet:
- of
- (in symbol MCD-01243, part A) MCU_IOs; MCU CLK & RST

### Library data of the parts
B1 = MCD-00002: Non-Open Push-Button 0.1A 24V; Manufacturer_Part_Number: TD0341X-G01-BLU; Manufacturer: WEALTHMETAL; Part_Type: Misc; Provided_By: Subcon; Initial_Board_Reference: MB1274; Internal_Part_Number: MCD-00002; ECCN_US: n/a; ECCN_EU: n/a; ComponentLink1Description: Wealthmetal_Tact-Switch_TD0341.pdf; Status: Released; ComponentLink1URL: http://tunmcdsvn.tun.st.com/Component_Datasheet_Library/Trunk/Misc/Wealthmetal_Tact-Switch_TD0341; Order_Code_Farnell: 535-930
B2 = MCD-00001: Non-Open Push-Button 0.1A 24V; Manufacturer_Part_Number: TD0341X-G01-BLA; Manufacturer: WEALTHMETAL; Part_Type: Misc; Provided_By: Subcon; Initial_Board_Reference: MB1274; Internal_Part_Number: MCD-00001; ECCN_US: n/a; ECCN_EU: n/a; ComponentLink1Description: Wealthmetal_Tact-Switch_TD0341.pdf; Status: Released; ComponentLink1URL: http://tunmcdsvn.tun.st.com/Component_Datasheet_Library/Trunk/Misc/Wealthmetal_Tact-Switch_TD0341; Order_Code_Farnell: 535-930
C34 C35 = MCD-00102: as C36 on sheet Power; Internal_Part_Number: MCD-00102; Status: Released; Package: C0402; ComponentLink1Description: Yageo_Capacitor_X7R-series.pdf; ECCN_US: n/a; ECCN_EU: n/a; Part_Type: Capacitor; ComponentLink1URL: http://tunmcdsvn.tun.st.com/Component_Datasheet_Library/Trunk/Capacitors/Yageo_Multilayer_Capacitor_X7R_series_100pF_to_22uF
C56 C59 = MCD-00674: Capacitor, MLCC, 6.8pF, 50V, NPO, +-0.25pF, 0402, T=0.5mm; Manufacturer_Part_Number: CC0402CRNPO9BN6R8; Manufacturer: YAGEO; Provided_By: Subcon; Initial_Board_Reference: MB1319; Internal_Part_Number: MCD-00674; Status: Released; Part_Type: Capacitor; Package: C0402; ComponentLink1Description: Yageo_Capacitor_NP0_16V-to-50V.pdf; ComponentLink1URL: http://tunmcdsvn.tun.st.com/Component_Datasheet_Library/Trunk/Capacitors/Yageo_Capacitor_NP0_16V-to-50V; ECCN_US: n/a; ECCN_EU: n/a
C57 C58 = MCD-00003: Capacitor, MLCC, 5.1pF, 50V, NPO, +-0.25pF, 0402, T=0.5mm; Manufacturer_Part_Number: CC0402CRNPO9BN5R1; Manufacturer: YAGEO; Provided_By: Subcon; Initial_Board_Reference: MB1274; Internal_Part_Number: MCD-00003; ECCN_US: n/a; ECCN_EU: n/a; ComponentLink1Description: Yageo_Capacitor_NP0_16V-to-50V.pdf; Status: Released; Part_Type: Capacitor; Package: C0402; ComponentLink1URL: http://tunmcdsvn.tun.st.com/Component_Datasheet_Library/Trunk/Capacitors/Yageo_Capacitor_NP0_16V-to-50V
HW17 = MCD-00634: Blue Hat for switch TD0341X-G01-BLU; Part_Type: Mechanical; Manufacturer_Part_Number: 988.16.09.3.00002_SH-517; Manufacturer: JIUBABA; Provided_By: Subcon; Initial_Board_Reference: MB1319; Internal_Part_Number: MCD-00634; Status: Released; ECCN_US: n/a; ECCN_EU: n/a; ComponentLink1Description: Jiubaba_HAT_SH-517.pdf; ComponentLink1URL: http://tunmcdsvn.tun.st.com/Component_Datasheet_Library/Trunk/Mechanical/Jiubaba_HAT_SH-517
HW18 = MCD-00635: Black Hat for switch TD0341X-G01-BLA; Part_Type: Mechanical; Manufacturer_Part_Number: 988.16.09.3.00003_SH-517; Manufacturer: JIUBABA; Provided_By: Subcon; Initial_Board_Reference: MB1319; Internal_Part_Number: MCD-00635; Status: Released; ECCN_US: n/a; ECCN_EU: n/a; ComponentLink1Description: Jiubaba_HAT_SH-517.pdf; ComponentLink1URL: http://tunmcdsvn.tun.st.com/Component_Datasheet_Library/Trunk/Mechanical/Jiubaba_HAT_SH-517
HW20 = MCD-00043: as HW5 on sheet Power; Internal_Part_Number: MCD-00043; ECCN_US: n/a; ECCN_EU: n/a; ComponentLink1Description: Samtec_Shunt_Jumper_SNT100.pdf; Status: Released; ComponentLink1URL: http://tunmcdsvn.tun.st.com/Component_Datasheet_Library/Trunk/Connectors/Samtec_Shunt_Jumper_SNT100
JP7 = MCD-00045: Header, 2x1, 2,54mm, VR, TH, Height 5.84mm/2.54mm; Part_Type: Connector; Manufacturer_Part_Number: TSW-102-07-x-S; Manufacturer: SAMTEC; Provided_By: Subcon; Initial_Board_Reference: MB1274; Internal_Part_Number: MCD-00045; Status: Released; ComponentLink1Description: Samtec_connector_TSW-HTSW-series.pdf; ComponentLink1URL: http://tunmcdsvn.tun.st.com/Component_Datasheet_Library/Trunk/Connectors/Samtec_TSW-HTSW-series; ECCN_US: n/a; ECCN_EU: n/a
R26 = MCD-00223: as R28 on sheet Arduino_extension_connectors; Internal_Part_Number: MCD-00223; ECCN_US: n/a; ECCN_EU: n/a; ComponentLink1Description: Yageo_Resistor_RC0603-series.pdf; Status: Released; Part_Type: Resistor; Package: R0603; ComponentLink1URL: http://tunmcdsvn.tun.st.com/Component_Datasheet_Library/Trunk/Resistors/Yageo_Resistor_RC0603-series
R27 = MCD-00197: Resistor,330R,0603,1%,1/10W; Manufacturer_Part_Number: RC0603FR-07330RL; Manufacturer: YAGEO; Provided_By: Subcon; Internal_Part_Number: MCD-00197; Status: Released; ComponentLink1Description: Yageo_Resistor_RC0603-series.pdf; ECCN_US: n/a; ECCN_EU: n/a; Part_Type: Resistor; Package: R0603; ComponentLink1URL: http://tunmcdsvn.tun.st.com/Component_Datasheet_Library/Trunk/Resistors/Yageo_Resistor_RC0603-series
R31 = MCD-00220: Resistor,10K,0603,1%,1/10W; Manufacturer_Part_Number: RC0603FR-0710KL; Manufacturer: YAGEO; Provided_By: Subcon; Initial_Board_Reference: MB1319; Internal_Part_Number: MCD-00220; ECCN_US: n/a; ECCN_EU: n/a; ComponentLink1Description: Yageo_Resistor_RC0603-series.pdf; Status: Released; Part_Type: Resistor; Package: R0603; ComponentLink1URL: http://tunmcdsvn.tun.st.com/Component_Datasheet_Library/Trunk/Resistors/Yageo_Resistor_RC0603-series
R32 = MCD-00481: Resistor,47R,0402,1%,1/16W; Manufacturer_Part_Number: RC0402FR-0747RL; Manufacturer: YAGEO; Provided_By: SUBCO; Internal_Part_Number: MCD-00481; Status: Released; Part_Type: Resistor; Package: R0402; ComponentLink1Description: Datasheet; ComponentLink1URL: http://tunmcdsvn.tun.st.com/Component_Datasheet_Library/Trunk/Resistors/Yageo_Resistor_RC0402-series
SB1 SB9 SB12 SB13 SB15-SB32 SB40 SB41 = MCD-00071: as SB2 on sheet Arduino_extension_connectors; Internal_Part_Number: MCD-00071; ECCN_US: n/a; ECCN_EU: n/a; Status: Released
U9 U10 = MCD-00170: ESD protection 6V1; Part_Type: Diode; Manufacturer: STMICROELECTRONICS; ECCN_US: EAR99; ECCN_EU: NEC; Provided_By: Subcon; Initial_Board_Reference: MB1274; Internal_Part_Number: MCD-00170; Status: Released; Manufacturer_Part_Number: ESDALC6V1-1U2; ComponentLink1Description: STM_ESD_ESDALC6V1-1U2.pdf; ComponentLink1URL: http://tunmcdsvn.tun.st.com/Component_Datasheet_Library/Trunk/Diodes/STM_ESD_ESDALC6V1-1U2
U13 = MCD-01243: STM32G474, LQFP64 package,  3D IC footprint with 2D socket footprint.; Manufacturer: STMICROELECTRONICS; Provided_By: SUBCO with ST control; Initial_Board_Reference: MB1367; Item Type: Item; Path: ws/MCD_ApplicationBoards/Lists/MCDPARTSdatabase; Internal_Part_Number: MCD-01243; Status: Checked; Part_Type: IC; Manufacturer_Part_Number: STM32G474RET6; Package: LQFP64; ComponentLink1Description: Datasheet; ComponentLink1URL: http://tunmcdsvn.tun.st.com/Component_Datasheet_Library/Trunk/IC/STM_MCU_STM32G4xx
X2 = MCD-00091: Crystal 32.768kHz, 6pF, -+20PPM, R=50K, SMD; Manufacturer_Part_Number: NX3215SA 32.768KHz EXS00A-MU00525; Manufacturer: NDK; Part_Type: Crystal_Osc; ECCN_US: EAR99; ECCN_EU: NEC; Provided_By: STM; Initial_Board_Reference: MB1274; Internal_Part_Number: MCD-00091; ComponentLink1Description: NDK_Crystal-For-ST_NX3215SA 32.768KHz EXS00A-MU00525 (EXS10B-21238).pdf; Status: Released; ComponentLink1URL: http://tunmcdsvn.tun.st.com/Component_Datasheet_Library/Trunk/Crystal_Osc/NDK_Crystal-For-ST_NX3215SA 32.768KHz EXS00A-MU00525 (EXS10B-21238)
X3 = MCD-01036: 24MHz crystal oscillator - Cl:6pf -; Part_Type: Crystal_Osc; Manufacturer_Part_Number: NX2016SA 24MHz EXS00A-CS10820; Manufacturer: NDK; ECCN_US: EAR99; ECCN_EU: NEC; Provided_By: Subcon; Initial_Board_Reference: MB1332; Internal_Part_Number: MCD-01036; Status: Footprint available; Package: (2016) 2.0 x 1.6 x 0.45 mm; ComponentLink1Description: ST-MICROELECTRONICS NX2016SA 24MHz EXS00A-CS10820  (EXS10B-27366).pdf; ComponentLink1URL: http://tunmcdsvn.tun.st.com/Component_Datasheet_Library/Trunk/Crystal_Osc/NDK_NX2016SA 24MHz EXS00A-CS10820 (EXS10B-27366)

## Sheet STM32_microcontroller_power.SchDoc: STM32 microcontroller power part
size A4; Date: Not used; ApprovedBy: Not used; CheckedBy: Not used; Author: Not used; CompanyName: STMicroelectronics; DrawnBy: Not used; Engineer: Not used; Organization: Not used; Address1: Not used; Address2: Not used; Address3: Not used; Address4: Not used; DocumentNumber: 4; Revision: Not used; SheetNumber: 4; SheetTotal: 8; CurrentTime: Not used; CurrentDate: Not used; Time: Not used; DocumentFullPathAndName: Not used; DocumentName: Not used; ModifiedDate: Not used; ImagePath: Not used; ProjectName: Not used; Application_BuildNumber: Not used
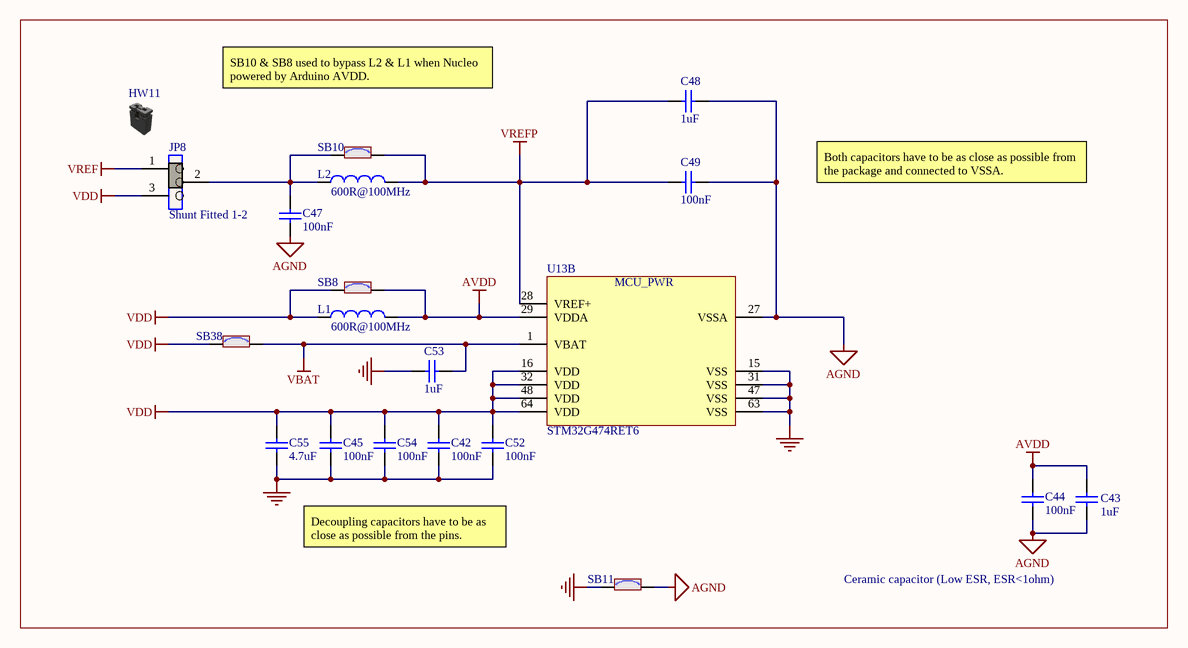
[diagram p5: STM32_microcontroller_power.SchDoc]

### Parts
C42  value 100nF  [C0402]
C43  value 1uF  [C0603]
C44  value 100nF  [C0402]
C45  value 100nF  [C0402]
C47  value 100nF  [C0402]
C48  value 1uF  [C0603]
C49  value 100nF  [C0402]
C52  value 100nF  [C0402]
C53  value 1uF  [C0603]
C54  value 100nF  [C0402]
C55  value 4.7uF  [C0603]
HW11  (no value)  (mechanical)
JP8  Shunt Fitted 1-2  [CON_SAMTEC_TSW-103-07-F-S]
L1  value 600R@100MHz  [L0603]
L2  value 600R@100MHz  [L0603]
SB8  (no value)  [SOLDER-BRIDGE_R0603-0R]
SB10  (no value)  [SOLDER-BRIDGE_R0603-0R]
SB11  (no value)  [SOLDER-BRIDGE_R0603-0R]
SB38  (no value)  [SOLDER-BRIDGE_R0603-0R]
U13  value STM32G474RET6  [ICC_LQFP64_10X10_P050_SOCKET_YAMAICHI_IC149-064-069-B5_NM]  (hidden comment: STM32G4xx_LQFP64)  (part B of 2)

### Blocks framed on the sheet
Ceramic capacitor (Low ESR, ESR<1ohm): C42-C45 C47-C49 C52-C55 HW11 JP8 L1 L2 SB8 SB10 SB11 SB38 U13

### Nets
AGND: C43.1 C44.1 C47.1 C48.2 C49.2 SB11.2 U13.27(VSSA)
AVDD: C43.2 C44.2 L1.2 SB8.2 U13.29(VDDA)
GND: C42.1 C45.1 C52.1 C53.1 C54.1 C55.1 SB11.1 U13.15(VSS) U13.31(VSS) U13.47(VSS) U13.63(VSS)
VBAT: C53.2 SB38.2 U13.1(VBAT)
VDD: C42.2 C45.2 C52.2 C54.2 C55.2 JP8.3 L1.1 SB8.1 SB38.1 U13.16(VDD) U13.32(VDD) U13.48(VDD) U13.64(VDD)
VREF: JP8.1
VREFP: C48.1 C49.1 L2.2 SB10.2 U13.28(VREF+)
NetC47_2: C47.2 JP8.2 L2.1 SB10.1

### Notes on the sheet
- SB10 & SB8 used to bypass L2 & L1 when Nucleo powered by Arduino AVDD.
- Both capacitors have to be as close as possible from the package and connected to VSSA.
- Decoupling capacitors have to be as close as possible from the pins.
- Title:
- Project:
- Size:
- Revision:
- Variant:
- A4
- -
- Date:
- Reference:
- Sheet:
- of
- (in symbol MCD-01243, part B) MCU_PWR

### Library data of the parts
C42 C44 C45 C47 C49 C52 C54 = MCD-00102: as C36 on sheet Power; Internal_Part_Number: MCD-00102; Status: Released; Package: C0402; ComponentLink1Description: Yageo_Capacitor_X7R-series.pdf; ECCN_US: n/a; ECCN_EU: n/a; Part_Type: Capacitor; ComponentLink1URL: http://tunmcdsvn.tun.st.com/Component_Datasheet_Library/Trunk/Capacitors/Yageo_Multilayer_Capacitor_X7R_series_100pF_to_22uF
C43 C48 C53 = MCD-00010: as C37 on sheet Power; Internal_Part_Number: MCD-00010; Status: Released; Package: C0603; ComponentLink1Description: Yageo_Capacitor_X5R-series.pdf; ECCN_US: n/a; ECCN_EU: n/a; Part_Type: Capacitor; ComponentLink1URL: http://tunmcdsvn.tun.st.com/Component_Datasheet_Library/Trunk/Capacitors/Yageo_Multilayer_capacitor_X5R_series_100pF_to_100uF
C55 = MCD-00009: Capacitor, MLCC, 4.7uF, 16V, X5R, 10%, 0603, T=0.8mm; Manufacturer_Part_Number: CC0603KRX5R7BB475; Manufacturer: YAGEO; Provided_By: subcon; Initial_Board_Reference: MB1274; Internal_Part_Number: MCD-00009; ComponentLink1Description: Yageo_Capacitor_X5R-series.pdf; ECCN_US: n/a; ECCN_EU: n/a; Status: Released; Part_Type: Capacitor; Package: C0603; ComponentLink1URL: http://tunmcdsvn.tun.st.com/Component_Datasheet_Library/Trunk/Capacitors/Yageo_Multilayer_capacitor_X5R_series_100pF_to_100uF
HW11 = MCD-00043: as HW5 on sheet Power; Internal_Part_Number: MCD-00043; ECCN_US: n/a; ECCN_EU: n/a; ComponentLink1Description: Samtec_Shunt_Jumper_SNT100.pdf; Status: Released; ComponentLink1URL: http://tunmcdsvn.tun.st.com/Component_Datasheet_Library/Trunk/Connectors/Samtec_Shunt_Jumper_SNT100
JP8 = MCD-00684: Header, 3x1, 2,54mm, VR, TH, Height 5.84mm/2.54mm - Shunt Fitted 1-2 by default; Part_Type: Connector; Manufacturer_Part_Number: TSW-103-07-F-S; Manufacturer: SAMTEC; Provided_By: Subcon; Initial_Board_Reference: MB1331; Internal_Part_Number: MCD-00684; Value: Shunt Fitted 1-2; Status: Released; ComponentLink1Description: Samtec_connector_TSW-HTSW-series.pdf; ComponentLink1URL: http://tunmcdsvn.tun.st.com/Component_Datasheet_Library/Trunk/Connectors/Samtec_TSW-HTSW-series; ECCN_US: n/a; ECCN_EU: n/a
L1 L2 = MCD-00047: SMD Chip ferrite bead, 600R@100MHz +/-25%, 350mA, 500mohm DC, 0603, T=0.8mm; Part_Type: Inductor; Manufacturer_Part_Number: FCM1608KF-601T03; Manufacturer: TAI-TECH; Provided_By: Subcon; Initial_Board_Reference: MB1274; Internal_Part_Number: MCD-00047; Status: Released; ComponentLink1Description: TaiTech_Bead_FCM1608_series.pdf; ComponentLink1URL: http://tunmcdsvn.tun.st.com/Component_Datasheet_Library/Trunk/Inductors/TaiTech_Bead_FCM1608_series; ECCN_US: n/a; ECCN_EU: n/a
SB8 SB10 SB11 SB38 = MCD-00071: as SB2 on sheet Arduino_extension_connectors; Internal_Part_Number: MCD-00071; ECCN_US: n/a; ECCN_EU: n/a; Status: Released
U13 = MCD-01243: as U13 on sheet STM32_microcontroller_IOs; Internal_Part_Number: MCD-01243; Status: Checked; Part_Type: IC; Manufacturer_Part_Number: STM32G474RET6; Package: LQFP64; ComponentLink1Description: Datasheet; ComponentLink1URL: http://tunmcdsvn.tun.st.com/Component_Datasheet_Library/Trunk/IC/STM_MCU_STM32G4xx